# Altium schematic sheet WS3.0_DISP.SchDoc
size A4
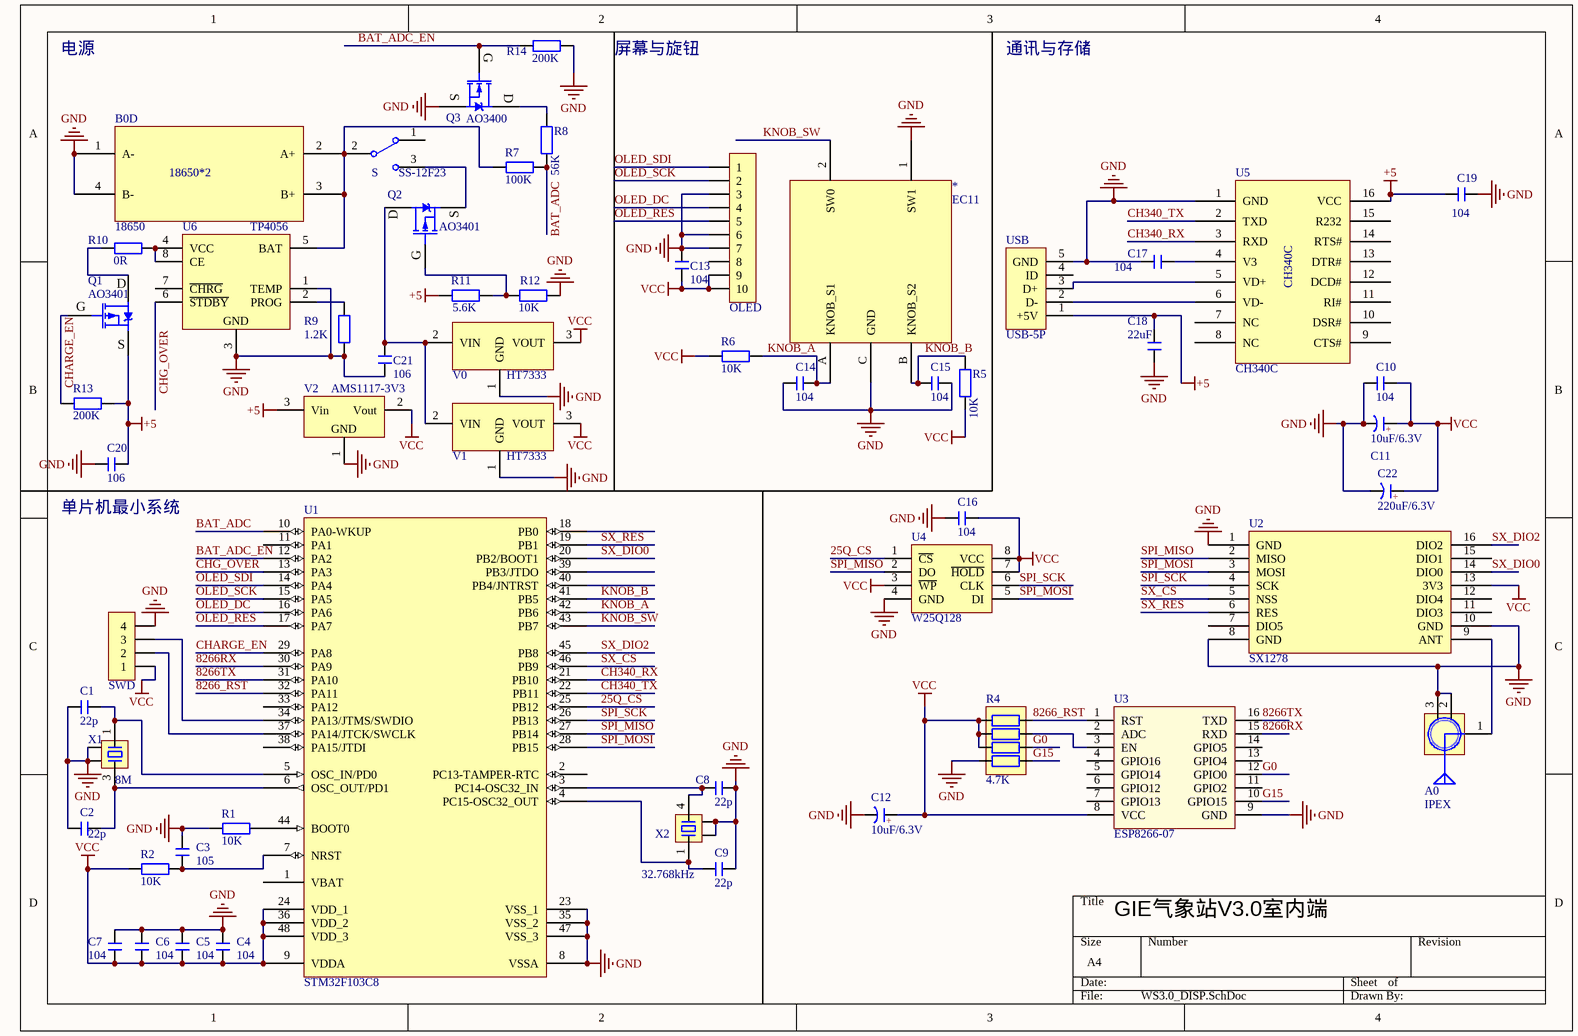
[diagram p0: WS3.0_DISP.SchDoc]

## Parts
*  EC11  [EC11]
A0  IPEX  [IPEX]
B0  18650  [18650]  (part D of 4)
C1  22p  [C 0603_L]
C2  22p  [C 0603_L]
C3  105  [C 0603_L]
C4  104  [C 0603_L]
C5  104  [C 0603_L]
C6  104  [C 0603_L]
C7  104  [C 0603_L]
C8  22p  [C 0603_L]
C9  22p  [C 0603_L]
C10  104  [C 0603_L]
C11  10uF/6.3V  [CD S(2012)]
C12  10uF/6.3V  [CD S(2012)]
C13  104  [C 0603_L]
C14  104  [C 0603_L]
C15  104  [C 0603_L]
C16  104  [C 0603_L]
C17  104  [C 0603_L]
C18  22uF  [C 0805_L]
C19  104  [C 0603_L]
C20  106  [C 0805_L]
C21  106  [C 0805_L]
C22  220uF/6.3V  [CD B(3528)]
OLED  FPC1.0-10P  [FPC1.0-2H-WS-10P]  (value not drawn)
Q1  AO3401  [SOT23-3N]
Q2  AO3401  [SOT23-3N]
Q3  AO3400  [SOT23-3N]
R1  10K  [R 0603_L]
R2  10K  [R 0603_L]
R4  4.7K  [RCA-8P4R-0603]
R5  10K  [R 0603_L]
R6  10K  [R 0603_L]
R7  100K  [R 0603_L]
R8  56K  [R 0603_L]
R9  1.2K  [R 0603_L]
R10  0R  [R 1206_L]
R11  5.6K  [R 0603_L]
R12  10K  [R 0603_L]
R13  200K  [R 0603_L]
R14  200K  [R 0603_L]
S  SS-12F23  [SS-12F23]
SWD  HDR-1X4  [HDR2.54-LI-4P]  (value not drawn)
U1  STM32F103C8  [LQFP48 7X7_M]
U2  SX1278  [SX1278]
U3  ESP8266-07  [ESP-07]
U4  W25Q128  [SOP8W_N]
U5  CH340C  [SOP16_N]
U6  TP4056  [SOP8_N]
USB  USB-5P  [USB-MICRO_A]
V0  HT7333  [SOT89_N]
V1  HT7333  [SOT89_N]
V2  AMS1117-3V3  [SOT223_L]
X1  8M  [OSC 3225-4P]
X2  32.768kHz  [OSC MC-146]

## Nets
+5: C18.2 C19.1 C20.1 Q1.2(S) R11.1 R13.1 U5.16(VCC) USB.1(+5V) V2.3(Vin)
GND: *.1(SW1) *.C(GND) A0.2(GND) A0.3(GND) B0.1(A-) B0.4(B-) C1.1 C2.1 C3.2 C4.2 C5.2 C6.2 C7.2 C8.2 C9.2 C10.2 C11.2(K) C12.2(K) C13.1 C14.2 C15.1 C16.2 C17.2 C18.1 C19.2 C20.2 C21.2 C22.2(K) OLED.3 OLED.6 OLED.7 Q3.2(S) R1.1 R4.4 R9.1 R12.2 R14.1 SWD.4 U1.8(VSSA) U1.23(VSS_1) U1.35(VSS_2) U1.47(VSS_3) U2.1(GND) U2.8(GND) U2.10(GND) U3.9(GND) U4.4(GND) U5.1(GND) U6.1(TEMP) U6.3(GND) USB.5(GND) V0.1(GND) V1.1(GND) V2.1(GND) X1.2 X1.4 X2.2 X2.3
VCC: C4.1 C5.1 C6.1 C7.1 C10.1 C11.1(A) C12.1(A) C13.2 C16.1 C22.1(A) OLED.9 OLED.10 R2.1 R4.1 R4.2 R4.3 R5.1 R6.2 SWD.1 U1.9(VDDA) U1.24(VDD_1) U1.36(VDD_2) U1.48(VDD_3) U2.13(3V3) U3.8(VCC) U4.3(~{WP}) U4.7(~{HOLD}) U4.8(VCC) V0.3(VOUT) V1.3(VOUT) V2.2(Vout)
25Q_CS: U1.25(PB12) U4.1(~{CS})
8266_RST: R4.8 U1.32(PA11) U3.1(RST)
8266RX: U1.30(PA9) U3.15(RXD)
8266TX: U1.31(PA10) U3.16(TXD)
BAT_ADC: R7.1 R8.1 U1.10(PA0-WKUP)
BAT_ADC_EN: Q3.1(G) R14.2 U1.12(PA2)
CH340_RX: U1.21(PB10) U5.3(RXD)
CH340_TX: U1.22(PB11) U5.2(TXD)
CHARGE_EN: Q1.1(G) R13.2 U1.29(PA8)
CHG_OVER: U1.13(PA3) U6.6(~{STDBY})
G0: R4.6 U3.12(GPIO0)
G15: R4.5 U3.10(GPIO15)
KNOB_A: *.A(KNOB_S1) C14.1 R6.1 U1.42(PB6)
KNOB_B: *.B(KNOB_S2) C15.2 R5.2 U1.41(PB5)
KNOB_SW: *.2(SW0) U1.43(PB7)
OLED_DC: OLED.4 U1.16(PA6)
OLED_RES: OLED.5 U1.17(PA7)
OLED_SCK: OLED.2 U1.15(PA5)
OLED_SDI: OLED.1 U1.14(PA4)
SPI_MISO: U1.27(PB14) U2.2(MISO) U4.2(DO)
SPI_MOSI: U1.28(PB15) U2.3(MOSI) U4.5(DI)
SPI_SCK: U1.26(PB13) U2.4(SCK) U4.6(CLK)
SX_CS: U1.46(PB9) U2.5(NSS)
SX_DIO0: U1.20(PB2/BOOT1) U2.14(DIO0)
SX_DIO2: U1.45(PB8) U2.16(DIO2)
SX_RES: U1.19(PB1) U2.6(RES)
NetA0_1: A0.1(ANT) U2.9(ANT)
NetB0_2: B0.2(A+) B0.3(B+) R7.2 S.2 U6.5(BAT)
NetC1_2: C1.2 U1.5(OSC_IN/PD0) X1.1
NetC2_2: C2.2 U1.6(OSC_OUT/PD1) X1.3
NetC3_1: C3.1 R2.2 U1.7(NRST)
NetC8_1: C8.1 U1.3(PC14-OSC32_IN) X2.4
NetC9_1: C9.1 U1.4(PC15-OSC32_OUT) X2.1
NetC17_1: C17.1 U5.4(V3)
NetC21_1: C21.1 Q2.3(D) V0.2(VIN) V1.2(VIN)
NetQ1_3: Q1.3(D) R10.2
NetQ2_1: Q2.1(G) R11.2 R12.1
NetQ2_2: Q2.2(S) S.3
NetQ3_3: Q3.3(D) R8.2
NetR1_2: R1.2 U1.44(BOOT0)
NetR4_7: R4.7 U3.3(EN)
NetR9_2: R9.2 U6.2(PROG)
NetR10_1: R10.1 U6.4(VCC) U6.8(CE)
NetSWD_2: SWD.2 U1.37(PA14/JTCK/SWCLK)
NetSWD_3: SWD.3 U1.34(PA13/JTMS/SWDIO)
NetU5_5: U5.5(VD+) USB.3(D+)
NetU5_6: U5.6(VD-) USB.2(D-)

Not connected (* = marked no-connect by the designer): OLED 8; S 1; U1 1(VBAT) 2(PC13-TAMPER-RTC) 11(PA1) 18(PB0) 33(PA12) 38(PA15/JTDI) 39(PB3/JTDO) 40(PB4/JNTRST); U2 7(DIO5) 11(DIO3) 12(DIO4) 15(DIO1); U3 2(ADC) 4(GPIO16) 5(GPIO14) 6(GPIO12) 7(GPIO13) 11(GPIO2) 13(GPIO4) 14(GPIO5); U5 7(NC) 8(NC) 9(CTS#) 10(DSR#) 11(RI#) 12(DCD#) 13(DTR#) 14(RTS#) 15(R232); U6 7(~{CHRG}); USB 4(ID)

## Notes on the sheet
- 电源
- 屏幕与旋钮
- 通讯与存储
- (near C20) 单片机最小系统
- GIE气象站V3.0室内端
- (in symbol 18650, part D) 18650*2
- (in symbol C-CD) +

## Library data of the parts
A0 = SMA: SMA-2.4G射频天线接口; 版权归属: 源创客; BOM名称: SMA-2.4G射频天线接口; 学习资源: www.ooocke.com
C1-C10 C13-C21 = C: 无极性贴片电容; 版权归属: 源创客; BOM名称: 无极性贴片电容; 学习资源: www.ooocke.com
C11 C12 C22 = C-CD: 贴片钽电容; 版权归属: 源创客; BOM名称: 贴片钽电容; 学习资源: www.ooocke.com
OLED = FPC-10P: FPC连接器; 版权归属: 源创客; BOM名称: FPC连接器; 学习资源: www.ooocke.com
Q1 Q2 = SI2301: P沟道场效应管; 版权归属: 源创客; BOM名称: P沟道场效应管; 学习资源: www.ooocke.com
Q3 = SI2302: N沟道场效应管; 版权归属: 源创客; BOM名称: N沟道场效应管; 学习资源: www.ooocke.com
R1 R2 R5-R14 = R: 贴片电阻; 版权归属: 源创客; BOM名称: 贴片电阻; 学习资源: www.ooocke.com
R4 = R-8P4R: 贴片网络排阻; 版权归属: 源创客; BOM名称: 贴片网络排阻; 学习资源: www.ooocke.com
S = SSW-1P: 1路波动开关; BOM名称: 波动开关; 版权归属: 源创客; 学习资源: www.ooocke.com
SWD = Header 4: 4P接插件; 版权归属: 源创客; BOM名称: 4P接插件; 学习资源: www.ooocke.com
U1 = STM32F103C8: Flaah:64/RAM:20/IO:36; BOM名称: 32位STM单片机; 版权归属: 源创客; 学习资源: www.ooocke.com
U3 = ESP8266-07: 串口 WIFI模块，ESP-07; BOM名称: WIFI模块; 版权归属: 源创客; 学习资源: www.ooocke.com
U4 = W25Qxx: 外置Flash; 版权归属: 源创客; BOM名称: 外置Flash; 学习资源: www.ooocke.com
U6 = TP4056: 锂电池充电管理; 版权归属: 源创客; BOM名称: 锂电池充电管理; 学习资源: www.ooocke.com
USB = USB-5P: 微型USB母座; 版权归属: 源创客; BOM名称: 微型USB母座; 学习资源: www.ooocke.com
V0 V1 = HT71xx: LDO线性稳压芯片; 版权归属: 源创客; BOM名称: LDO线性稳压芯片; 学习资源: www.ooocke.com
V2 = AMS1117: 三端稳压芯片; BOM名称: 稳压芯片; 版权归属: 源创客; 学习资源: www.ooocke.com
X1 = XTAL-4P: 4脚无源晶振; 版权归属: 源创客; BOM名称: 4脚无源晶振; 学习资源: www.ooocke.com
X2 = XTAL-MC-4P: MC系列4脚晶振; BOM名称: 2脚无源脚晶振; 版权归属: 源创客; 学习资源: www.ooocke.com